# EAGLE design PowerDistribution (EAGLE 6.5.0)
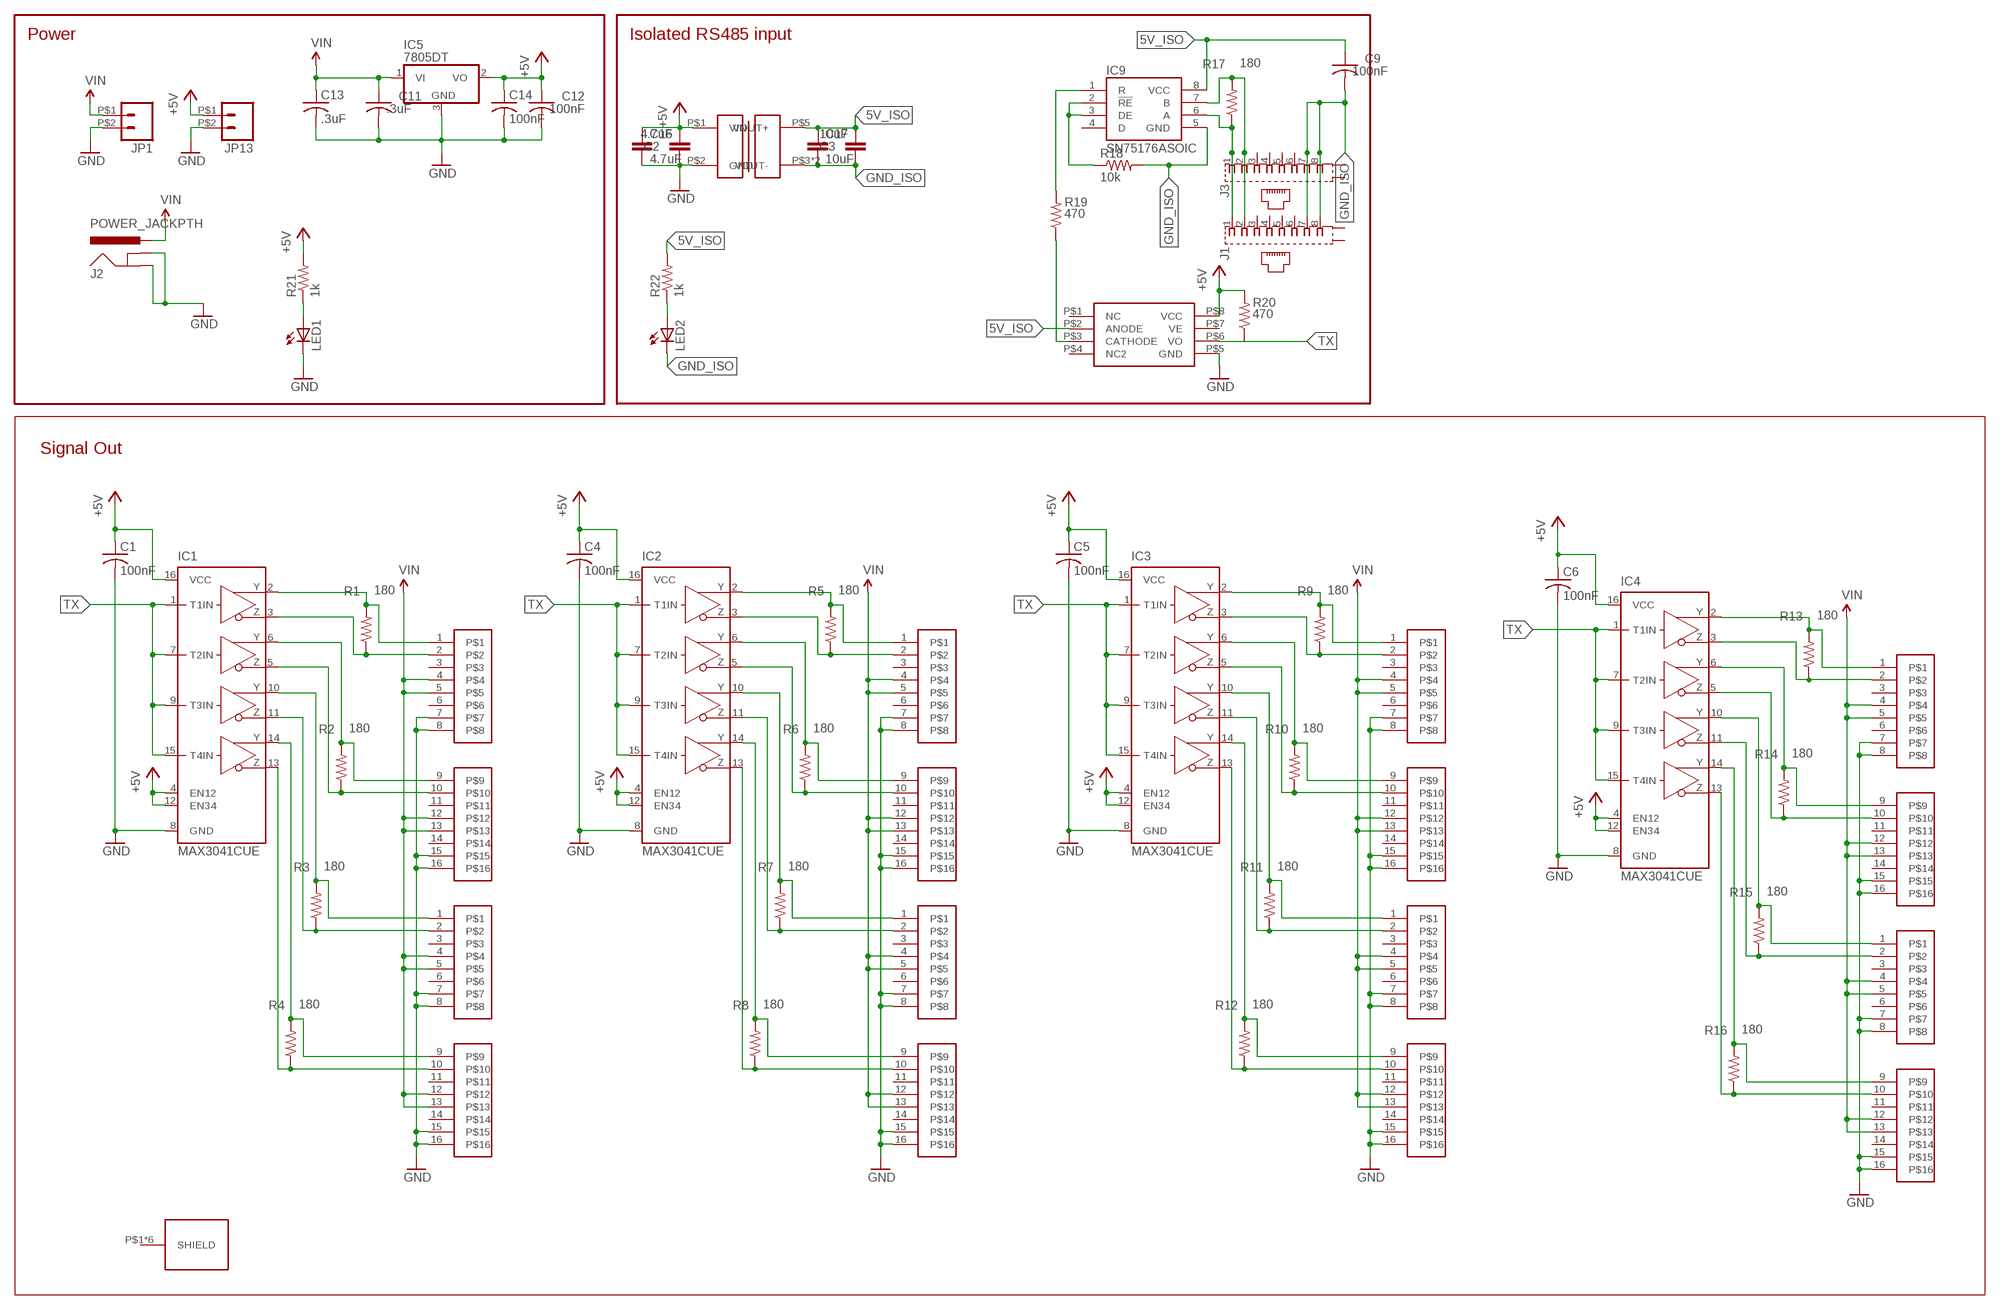
[diagram p0: schematic, sheet 1]

## Parts
C1  100nF  C-USC0603  [C0603]
C2  4.7uF  CAP0805  [0805]
C3  10uF  CAP0805  [0805]
C4  100nF  C-USC0603  [C0603]
C5  100nF  C-USC0603  [C0603]
C6  100nF  C-USC0603  [C0603]
C9  100nF  C-USC0603  [C0603]
C11  .3uF  C-USC0603K  [C0603K]
C12  100nF  C-USC0603K  [C0603K]
C13  .3uF  C-USC0603K  [C0603K]
C14  100nF  C-USC0603K  [C0603K]
C16  4.7uF  CAP1210  [1210]
C17  10uF  CAP1210  [1210]
IC1  MAX3041CUE  [TSSOP16]
IC2  MAX3041CUE  [TSSOP16]
IC3  MAX3041CUE  [TSSOP16]
IC4  MAX3041CUE  [TSSOP16]
IC5  7805DT  [TO252]
IC9  SN75176ASOIC  [SO08]
J1  555153-1  [555153-1]
J2  POWER_JACKPTH  [POWER_JACK_PTH]
J3  555153-1  [555153-1]
JP1  M026.35MM  [SCREWTERMINAL-6.35MM-2]
JP13  M026.35MM  [SCREWTERMINAL-6.35MM-2]
LED1  LED5MM  [LED5MM]
LED2  LED5MM  [LED5MM]
R1  180  R-US_R0603  [R0603]
R2  180  R-US_R0603  [R0603]
R3  180  R-US_R0603  [R0603]
R4  180  R-US_R0603  [R0603]
R5  180  R-US_R0603  [R0603]
R6  180  R-US_R0603  [R0603]
R7  180  R-US_R0603  [R0603]
R8  180  R-US_R0603  [R0603]
R9  180  R-US_R0603  [R0603]
R10  180  R-US_R0603  [R0603]
R11  180  R-US_R0603  [R0603]
R12  180  R-US_R0603  [R0603]
R13  180  R-US_R0603  [R0603]
R14  180  R-US_R0603  [R0603]
R15  180  R-US_R0603  [R0603]
R16  180  R-US_R0603  [R0603]
R17  180  R-US_R0603  [R0603]
R18  10k  R-US_R0603  [R0603]
R19  470  R-US_R0603  [R0603]
R20  470  R-US_R0603  [R0603]
R21  1k  R-US_R0603  [R0603]
R22  1k  R-US_R0603  [R0603]
U$1  RJ45_8X2_JACK  [RJ45_8X2_JACK]
U$2  RJ45_8X2_JACK  [RJ45_8X2_JACK]
U$3  6N137  [8_SOIC]
U$4  RJ45_8X2_BASE  [RJ45_8X2_BASE]
U$5  RJ45_8X2_JACK  [RJ45_8X2_JACK]
U$6  RJ45_8X2_JACK  [RJ45_8X2_JACK]
U$7  RJ45_8X2_JACK  [RJ45_8X2_JACK]
U$8  RJ45_8X2_JACK  [RJ45_8X2_JACK]
U$9  RJ45_8X2_JACK  [RJ45_8X2_JACK]
U$10  DC_DC_ISOLATED_0505  [IB_XLS-1W]
U$11  RJ45_8X2_JACK  [RJ45_8X2_JACK]

## Nets
5V_ISO: C3.2 C9.1 C17.1 IC9.8(VCC) R22.2 U$3.P$2(ANODE) U$10.P$5(VOUT+)
+5V: C1.1 C2.2 C4.1 C5.1 C6.1 C12.1 C14.1 C16.1 IC1.4(EN12) IC1.12(EN34) IC1.16(VCC) IC2.4(EN12) IC2.12(EN34) IC2.16(VCC) IC3.4(EN12) IC3.12(EN34) IC3.16(VCC) IC4.4(EN12) IC4.12(EN34) IC4.16(VCC) IC5.2(VO) JP13.P$1 R20.2 R21.2 U$3.P$8(VCC) U$10.P$1(VIN)
D9: IC9.2(!RE) IC9.3(DE) R18.1
GND [power]: C1.2 C2.1 C4.2 C5.2 C6.2 C11.2 C12.2 C13.2 C14.2 C16.2 IC1.8(GND) IC2.8(GND) IC3.8(GND) IC4.8(GND) IC5.3(GND) J2.GND J2.GNDBREAK JP1.P$2 JP13.P$2 LED1.K(C) U$1.7 U$1.8 U$1.15 U$1.16 U$2.7 U$2.8 U$2.15 U$2.16 U$3.P$5(GND) U$5.7 U$5.8 U$5.15 U$5.16 U$6.7 U$6.8 U$6.15 U$6.16 U$7.7 U$7.8 U$7.15 U$7.16 U$8.7 U$8.8 U$8.15 U$8.16 U$9.7 U$9.8 U$9.15 U$9.16 U$10.P$2(GND) U$11.7 U$11.8 U$11.15 U$11.16
GND_ISO: C3.1 C9.2 C17.2 IC9.5(GND) J1.7 J1.8 J3.7 J3.8 LED2.K(C) R18.2 U$10.P$3(VOUT-) U$10.P$4(VOUT-)
N$1: R19.1 U$3.P$3(CATHODE)
N$2: IC1.2(Y1) R1.2 U$5.1
N$3: IC9.1(R) R19.2
N$4: IC1.3(Z1) R1.1 U$5.2
N$5: IC1.13(Z4) R4.1 U$8.10
N$6: IC1.14(Y4) R4.2 U$8.9
N$7: IC1.11(Z3) R3.1 U$8.2
N$8: IC2.2(Y1) R5.2 U$1.1
N$9: IC1.10(Y3) R3.2 U$8.1
N$10: IC1.5(Z2) R2.1 U$5.10
N$11: IC1.6(Y2) R2.2 U$5.9
N$12: IC2.3(Z1) R5.1 U$1.2
N$13: IC2.13(Z4) R8.1 U$2.10
N$14: IC2.14(Y4) R8.2 U$2.9
N$15: IC2.11(Z3) R7.1 U$2.2
N$16: IC2.5(Z2) R6.1 U$1.10
N$17: IC2.6(Y2) R6.2 U$1.9
N$18: IC2.10(Y3) R7.2 U$2.1
N$19: IC3.2(Y1) R9.2 U$6.1
N$20: IC3.3(Z1) R9.1 U$6.2
N$21: IC3.13(Z4) R12.1 U$7.10
N$22: IC3.14(Y4) R12.2 U$7.9
N$23: IC3.11(Z3) R11.1 U$7.2
N$24: IC3.5(Z2) R10.1 U$6.10
N$25: IC3.6(Y2) R10.2 U$6.9
N$26: IC3.10(Y3) R11.2 U$7.1
N$27: IC4.2(Y1) R13.2 U$9.1
N$28: IC4.3(Z1) R13.1 U$9.2
N$29: IC4.13(Z4) R16.1 U$11.10
N$30: IC4.14(Y4) R16.2 U$11.9
N$31: IC4.11(Z3) R15.1 U$11.2
N$32: IC4.5(Z2) R14.1 U$9.10
N$33: IC4.6(Y2) R14.2 U$9.9
N$34: IC4.10(Y3) R15.2 U$11.1
N$35: J1.3
N$36: J1.4
N$37: J1.5
N$38: J1.6
N$39: LED1.A R21.1
N$40: LED2.A R22.1
RS485A9: IC9.6(A) J1.1 J3.1 R17.1
RS485B9: IC9.7(B) J1.2 J3.2 R17.2
TX: IC1.1(T1IN) IC1.7(T2IN) IC1.9(T3IN) IC1.15(T4IN) IC2.1(T1IN) IC2.7(T2IN) IC2.9(T3IN) IC2.15(T4IN) IC3.1(T1IN) IC3.7(T2IN) IC3.9(T3IN) IC3.15(T4IN) IC4.1(T1IN) IC4.7(T2IN) IC4.9(T3IN) IC4.15(T4IN) R20.1 U$3.P$6(VO)
VIN: C11.1 C13.1 IC5.1(VI) J2.PWR JP1.P$1 U$1.4 U$1.5 U$1.12 U$1.13 U$2.4 U$2.5 U$2.12 U$2.13 U$5.4 U$5.5 U$5.12 U$5.13 U$6.4 U$6.5 U$6.12 U$6.13 U$7.4 U$7.5 U$7.12 U$7.13 U$8.4 U$8.5 U$8.12 U$8.13 U$9.4 U$9.5 U$9.12 U$9.13 U$11.4 U$11.5 U$11.12 U$11.13
Unconnected: IC9.4(D) J1.G1(S1) J1.G2(S2) J3.3 J3.4 J3.5 J3.6 J3.G1(S1) J3.G2(S2) U$1.3 U$1.6 U$1.11 U$1.14 U$2.3 U$2.6 U$2.11 U$2.14 U$3.P$1(NC) U$3.P$4(NC2) U$3.P$7(VE) U$4.P$1(SHIELD) U$4.P$2(SHIELD) U$4.P$3(SHIELD) U$4.P$4(SHIELD) U$4.P$5(SHIELD) U$4.P$6(SHIELD) U$5.3 U$5.6 U$5.11 U$5.14 U$6.3 U$6.6 U$6.11 U$6.14 U$7.3 U$7.6 U$7.11 U$7.14 U$8.3 U$8.6 U$8.11 U$8.14 U$9.3 U$9.6 U$9.11 U$9.14 U$11.3 U$11.6 U$11.11 U$11.14

## Notes on the sheet
- Power | Isolated RS485 input
- Signal Out

## Library data of the parts
C1 C4-C6 C9 C11-C14 = adafruit:C-US: CAPACITOR, American symbol
C2 C3 C16 C17 = SparkFun:CAP: Capacitor Standard 0603 ceramic capacitor, and 0.1" leaded capacitor.
IC1-IC4 = maxim:MAX30*: ±10kV ESD-Protected, Quad 5V RS-485/RS-422 Transmitters Source: www.maxim-ic.com .. MAX3040-MAX3045.pdf; MPN: MAX3041CUE+; OC_FARNELL: unknown; OC_NEWARK: 73K8525
IC5 = linear:78*: Positive VOLTAGE REGULATOR Source: http://cache.national.com/ds/LM/LM78L05.pdf http://www.fairchildsemi.com/ds/LM/LM7805.pdf
IC9 = reprap:SN75176A
J1 J3 = con-amp:555153-1: AMP connector
J2 = SparkFun:POWER_JACK: Power Jack This is the standard 5.5mm barrel jack for power. The PTH is the most common, proven, reliable, footprint. All others are experimental. The Slot footprint only works if the mill layer is transmitted to the PCB fab house so be warned. Spark Fun Electronics SKU : PRT-00119. Mating wall wart : TOL-00298 (and others)
JP1 JP13 = SparkFun:M02: Header 2 Standard 2-pin 0.1" header. Use with straight break away headers (SKU : PRT-00116), right angle break away headers (PRT-00553), swiss pins (PRT-00743), machine pins (PRT-00117), and female headers (PRT-00115). Molex polarized connector foot print use with SKU : PRT-08233 with associated crimp pins and housings.
LED1 LED2 = SparkFun:LED: LEDs Standard schematic elements and footprints for 5mm, 3mm, 1206, and 0603 sized LEDs. 5mm - Spark Fun Electronics SKU : COM-00529 (and others)
R1-R22 = adafruit:R-US_: RESISTOR, American symbol
U$1 U$2 U$5-U$9 U$11 = LEDscape:RJ45_8X2_JACK
U$3 = sonos_library:6N137
U$4 = LEDscape:RJ45_8X2_BASE
U$10 = blinkinlabs:DC_DC_ISOLATED_0505: Galvanicly isolated 5v:5v converter. Could be a

## Net classes
0 default: width 0.254 mm
1 power: width 0.406 mm

## Board
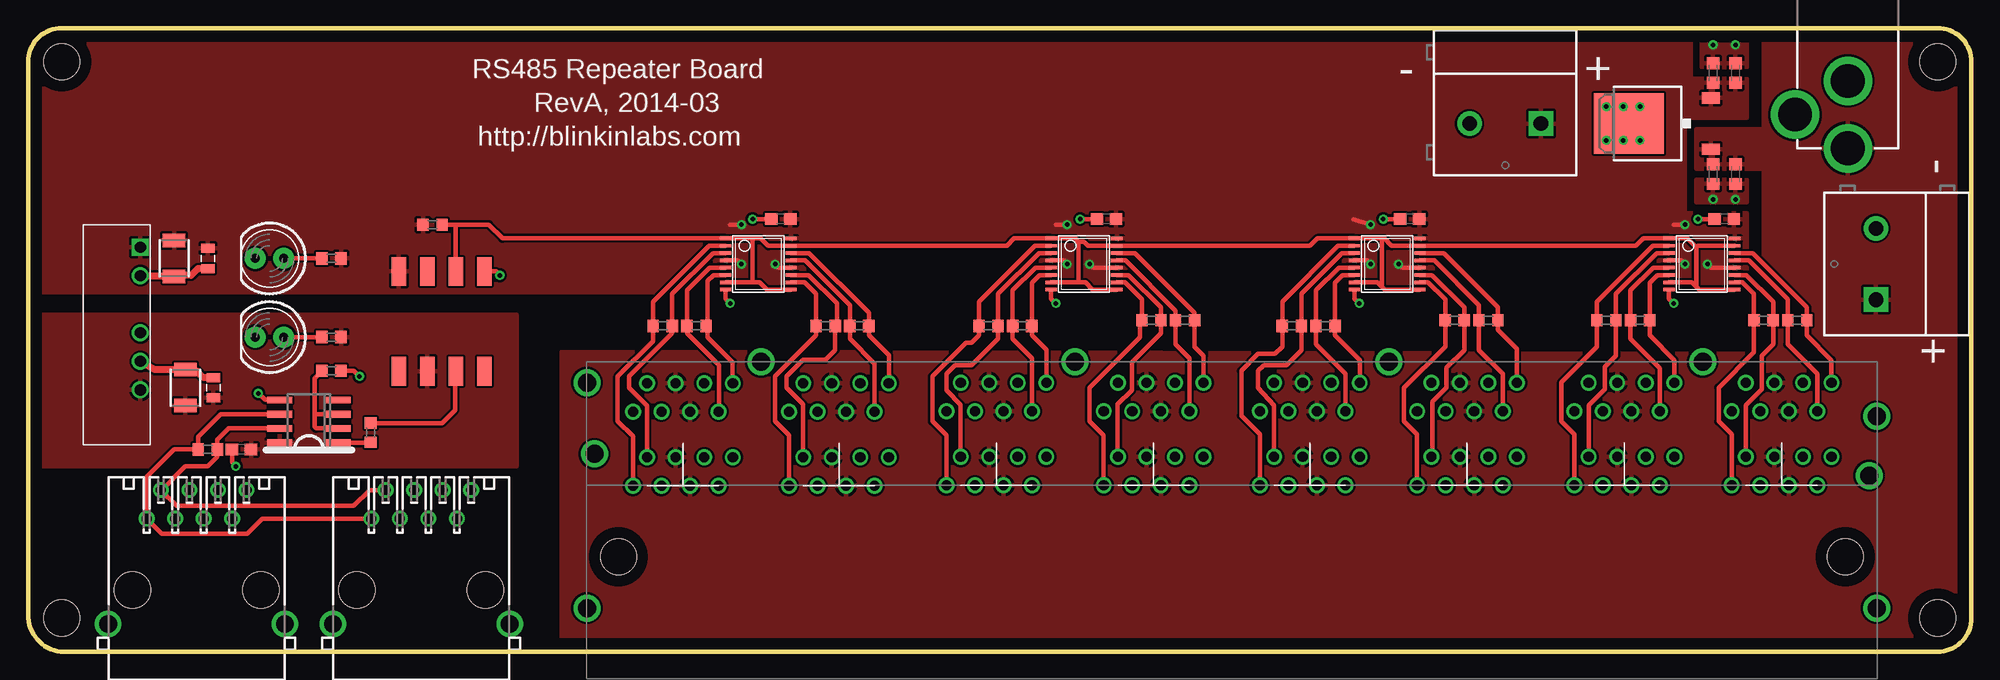
[diagram p1: board, top side]
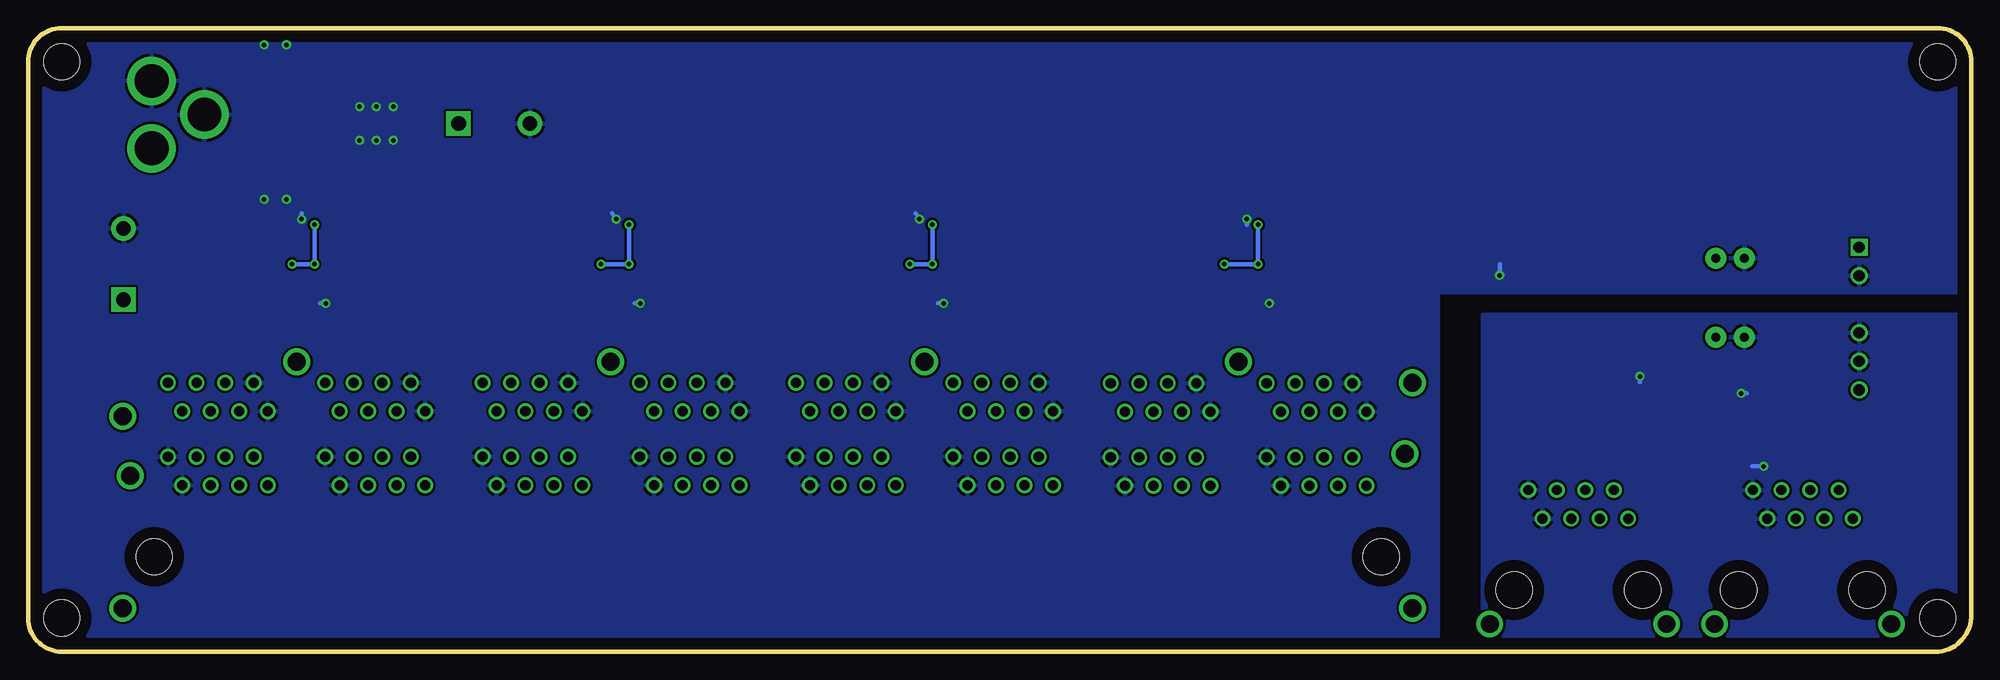
[diagram p2: board, bottom side, seen from below]

Size 173 x 55.51 mm. Coordinates in mm from the lower left corner, seen from the top.
Outline: 0,52.51 0,3.01 arc90 3.5,0.01 170,0.01 arc90 173,3.01 173,52.51 arc90 170,55.51 3,55.51 arc90 0,52.51
Copper layers (1*16): Top 0.035mm / dielectric 1.5mm / Bottom 0.035mm
Design rules "default *": minimum track width 10mil, minimum drill 0.3mm, track to track 8mil, track to pad 8mil, pad to pad 8mil, via to via 8mil, smd to smd 8mil, copper to edge 40mil, drill to drill 8mil, minimum pad ring 10mil, minimum via ring 8mil, stop-mask expansion 4mil, vias tented up to drill 0mil, thermal gap 10mil
Holes 3.2 mm at 3,52.51 3,3.01 170,3.01 170,52.51

### Footprints (pad centres in the part's own frame; a part is rotated, then mirrored left to right if it is on the bottom)
C0603 = smd 1.1 x 1: 1 -0.85,0; 2 0.85,0
0805 = smd 0.8 x 1.2: 1 -0.9,0; 2 0.9,0
C0603K = smd 1.05 x 1.08: 1 -0.875,0; 2 0.875,0
1210 = smd 1.2 x 2: 1 -1.6,0; 2 1.6,0
TSSOP16 = smd 0.305 x 0.991: 1 -2.275,-2.918; 2 -1.625,-2.918; 3 -0.975,-2.918; 4 -0.325,-2.918; 5 0.325,-2.918; 6 0.975,-2.918; 7 1.625,-2.918; 8 2.275,-2.918; 9 2.275,2.918; 10 1.625,2.918; 11 0.975,2.918; 12 0.325,2.918; 13 -0.325,2.918; 14 -0.975,2.918; 15 -1.625,2.918; 16 -2.275,2.918
TO252 = smd 1 x 1.6: 1 -2.28,-4.8; 2 2.28,-4.8 | smd 5.4 x 6.2: 3 0,2.5
SO08 = smd 0.6 x 2.2: 1 -1.905,-2.6; 2 -0.635,-2.6; 3 0.635,-2.6; 4 1.905,-2.6; 5 1.905,2.6; 6 0.635,2.6; 7 -0.635,2.6; 8 -1.905,2.6
555153-1 = drill 0.889: 1 -4.445,6.35; 2 -3.175,8.89; 3 -1.905,6.35; 4 -0.635,8.89; 5 0.635,6.35; 6 1.905,8.89; 7 3.175,6.35; 8 4.445,8.89 | drill 1.575 pad 2.184: G1 -7.874,-3.048; G2 7.874,-3.048 | hole 3.251: -5.715,0; 5.715,0
POWER_JACK_PTH = drill 2.997 pad 4.318: GND 0,7.7; GNDBREAK 4.7,10.7; PWR 0,13.7
SCREWTERMINAL-6.35MM-2 = drill 1.3 pad 2.184 square: P$1 -3.175,0 | drill 1.3 pad 2.184: P$2 3.175,0
LED5MM = drill 0.813 pad 1.88: A -1.27,0; K 1.27,0
R0603 = smd 1 x 1.1: 1 -0.85,0; 2 0.85,0
RJ45_8X2_JACK = drill 0.9: 1 -4.445,0; 2 -3.175,2.54; 3 -1.905,0; 4 -0.635,2.54; 5 0.635,0; 6 1.905,2.54; 7 3.175,0; 8 4.445,2.54; 9 4.445,9.14; 10 3.175,6.6; 11 1.905,9.14; 12 0.635,6.6; 13 -0.635,9.14; 14 -1.905,6.6; 15 -3.175,9.14; 16 -4.445,6.6
8_SOIC = smd 1.27 x 2.54: P$1 0,-2.54; P$2 2.54,-2.54; P$3 5.08,-2.54; P$4 7.62,-2.54; P$5 7.62,6.35; P$6 5.08,6.35; P$7 2.54,6.35; P$8 0,6.35
RJ45_8X2_BASE = drill 1.6: P$1 -57.4,15.5; P$2 -56.73,9.15; P$3 -57.4,-4.57; P$4 57.4,12.5; P$5 56.73,7.22; P$6 57.4,-4.57; P$7 13.97,17.35; P$8 41.91,17.35; P$9 -41.91,17.35; P$10 -13.97,17.35 | hole 3.2: -54.61,0; 54.61,0
IB_XLS-1W = drill 1 square: P$1 0,0 | drill 1: P$2 2.54,0; P$3 7.62,0; P$4 10.16,0; P$5 12.7,0

### Placement (x,y rotation side)
C1  67,38.51 180 top
C2  16,35.01 90 top
C3  16.5,23.51 270 top
C4  96,38.51 180 top
C5  123,38.51 180 top
C6  151,38.51 180 top
C9  19,18.01 180 top
C11  150,42.51 270 top
C12  152,51.51 90 top
C13  152,42.51 270 top
C14  150,51.51 90 top
C16  13,35.01 270 top
C17  14,23.51 90 top
IC1  65,34.51 270 top
IC2  94,34.51 270 top
IC3  121,34.51 270 top
IC4  149,34.51 270 top
IC5  145,47.01 90 top
IC9  25,20.51 90 top
J1  15,5.51 0 top
J2  162,58.51 180 top
J3  35,5.51 0 top
JP1  164.5,34.51 90 top
JP13  131.5,47.01 180 top
LED1  21.5,35.01 180 top
LED2  21.5,28.01 180 top
R1  56.5,29.01 180 top
R2  59.5,29.01 0 top
R3  71,29.01 180 top
R4  74,29.01 0 top
R5  85.5,29.01 180 top
R6  88.5,29.01 0 top
R7  100,29.51 180 top
R8  103,29.51 0 top
R9  112.5,29.01 180 top
R10  115.5,29.01 0 top
R11  127,29.51 180 top
R12  130,29.51 0 top
R13  140.5,29.51 180 top
R14  143.5,29.51 0 top
R15  154.5,29.51 180 top
R16  157.5,29.51 0 top
R17  16,18.01 0 top
R18  27,25.01 0 top
R19  30.5,19.51 270 top
R20  36,38.01 180 top
R21  27,35.01 0 top
R22  27,28.01 0 top
U$1  86.2,14.81 0 top
U$2  100.2,14.81 0 top
U$3  33,27.51 0 top
U$4  107.16,8.46 0 top
U$5  58.29,14.77 0 top
U$6  114.1,14.81 0 top
U$7  128.1,14.81 0 top
U$8  72.18,14.77 0 top
U$9  142.1,14.81 0 top
U$10  10,36.01 270 top
U$11  156.1,14.81 0 top

### Tracks (layer width: path | path; a pad name or v marks a point on that pad's centre or on a via)
5V_ISO
  pour Top: 43.5,30.01 0,30.01 0,16.51 43.5,16.51
+5V  (via drill 0.4)
  Top 0.406: IC1.4 63.17,34.83 v63.5,34.51 | IC1.12 66.83,34.18 v66.5,34.51 | v63.5,38.01 62.5,38.01 | IC2.4 92.17,34.83 v92.5,34.51 | v92.5,38.01 91.5,38.01 | IC2.12 94.83,34.18 v94.5,34.51 | IC3.4 119.17,34.83 v119.5,34.51 | v119.5,38.01 118,38.51 | IC3.12 122.33,34.18 v122,34.51 | IC4.4 147.18,34.83 v147.5,34.51 | v147.5,38.01 146.5,38.01 | IC4.12 149.82,34.18 v149.5,34.51
  Bottom 0.406: v63.5,38.01 v63.5,34.51 v66.5,34.51 | v92.5,38.01 v92.5,34.51 v94.5,34.51 | v119.5,38.01 v119.5,34.51 v122,34.51 | v147.5,38.01 v147.5,34.51 v149.5,34.51
  pour Top: 0,32.01 149,32.01 153,31.51 153,39.01 147.5,39.01 147.5,47.51 153,47.51 153,51.01 148,51.01 148,55.51 0,55.51
D9
  Top 0.406: IC9.3 25.5,21.14 | 25.5,21.14 25.5,24.36 R18.1 | IC9.2 25.64,19.87 25.5,20.01 25.5,21.14
GND  (via drill 0.4)
  Top 0.406: IC3.8 118.08,31.43 v118.5,31.01 | C5.2 v120.65,38.51 | C4.2 v93.65,38.51 | IC2.8 91.08,31.43 v91.5,31.01 | IC1.8 62.08,31.43 v62.5,31.01 | C1.2 v64.5,38.51 | C6.2 v148.65,38.51 | IC4.8 146.08,31.43 v146.5,31.01 | U$3.P$5 41.65,33.86 v42,33.51 | v143.5,45.51 143.5,46.01 IC5.3
  Top 0.61: U$10.P$2 12.94,33.47 C16.2 13.1,33.51 14.5,33.51 15.1,34.11 C2.1
  Bottom 0.406: v118.5,31.01 119,31.01 | v120.65,38.51 121,39.01 | v93.65,38.51 94,39.01 | v91.5,31.01 92,31.01 | v64.5,38.51 64.5,38.01 | v148.65,38.51 148.65,39.01 | v146.5,31.01 147,31.01 | v42,33.51 42,34.51
  other vias: 152,54.01 150,54.01 150,40.26 152,40.26 140.5,48.51 143.5,48.51 140.5,45.51 142,48.51 142,45.51
  pour Bottom: 47.5,0.01 173,0.01 173,55.51 0,55.51 0,32.01 47.5,32.01
  pour Top: 148.5,42.01 153,42.01 153,40.01 148.5,40.01
  pour Top: 149,54.51 153,54.51 153,52.01 149,52.01
GND_ISO  (via drill 0.4)
  Top 0.406: C9.2 18.15,16.86 v18.5,16.51 | IC9.5 21.09,22.41 v20.5,23.01 | R18.2 29,25.01 v29.5,24.51
  Top 0.61: U$10.P$4 11.26,25.11 C17.2 14.1,25.01 15,25.01 15.6,24.41 C3.1
  Bottom 0.406: v18.5,16.51 19.5,16.51 | v20.5,23.01 20,23.01 | v29.5,24.51 29.5,24.01
  pour Bottom: 43.5,-1.49 0,0.01 0,30.01 43.5,30.01
N$1
  Top 0.406: R19.1 36.85,20.36 38,21.51 38,24.89 U$3.P$3
N$2
  Top 0.406: IC1.2 60.62,36.13 55.65,31.16 R1.2 55.65,27.66 52.5,24.51 52.5,20.51 53.84,19.16 U$5.1
N$3
  Top 0.406: IC9.1 29.95,18.6 R19.2
N$4
  Top 0.406: IC1.3 60.98,35.48 57.35,31.86 R1.1 57.35,28.36 53.5,24.51 53.5,23.51 55.12,21.89 U$5.2
N$5
  Top 0.406: U$8.10 75.36,25.65 73.15,27.86 R4.1 73.15,30.86 69.17,34.83 IC1.13
N$6
  Top 0.406: U$8.9 76.62,26.38 74.85,28.16 R4.2 74.85,30.16 69.53,35.48 IC1.14
N$7
  Top 0.254: U$8.2 | 72,29.16 R3.1
  Top 0.406: R3.1 71.85,26.86 71,26.01 69,26.01 67.5,24.51 67.5,23.51 69,22.01 U$8.2 | IC1.11 69.47,33.53 72,31.01 72,29.16
N$8
  Top 0.406: IC2.2 89.62,36.13 84.65,31.16 R5.2 84.65,28.16 84,27.51 83.5,27.51 80.5,24.51 80.5,20.51 81.75,19.25 U$1.1
N$9
  Top 0.406: U$8.1 67.73,19.27 66.5,20.51 66.5,24.51 70.15,28.16 R3.2 70.15,31.86 69.12,32.88 IC1.10
N$10
  Top 0.254: 61.5,21.4 U$5.10
  Top 0.406: 61.5,21.4 61.5,25.51 58.65,28.36 R2.1 58.65,32.16 60.67,34.18 IC1.5
N$11
  Top 0.254: 60.5,28.86 R2.2 60.5,29.01
  Top 0.406: U$5.9 62.73,25.77 60.5,28.01 60.5,28.86 | 60.5,29.01 60.5,33.01 61.02,33.53 IC1.6
N$12
  Top 0.406: IC2.3 89.97,35.48 86.35,31.86 R5.1 86.35,27.86 84,25.51 82.5,25.51 81.75,24.76 81.75,23.26 83.03,21.98 U$1.2
N$13
  Top 0.406: U$2.10 103.38,26.13 102.15,27.36 R8.1 102.15,30.36 97.67,34.83 IC2.13
N$14
  Top 0.406: U$2.9 104.64,26.36 103.85,27.16 R8.2 103.85,30.16 98.53,35.48 IC2.14
N$15
  Top 0.406: U$2.2 97,17.37 97,22.01 98.25,23.26 98.25,25.76 100.85,28.36 R7.1 100.85,30.66 97.97,33.53 IC2.11
N$16
  Top 0.406: IC2.5 89.67,34.18 87.65,32.16 R6.1 87.65,27.86 89.38,26.13 U$1.10
N$17
  Top 0.406: IC2.6 90.03,33.53 89.35,32.86 R6.2 89.35,28.16 90.64,26.86 U$1.9
N$18
  Top 0.406: U$2.1 95.75,19.25 94.5,20.51 94.5,23.51 99,28.01 99,29.36 R7.2 99.15,31.36 97.62,32.88 IC2.10
N$19
  Top 0.406: U$6.1 109.66,19.35 108,21.01 108,25.01 109.5,26.51 111,26.51 111.65,27.16 R9.2 111.65,31.16 116.62,36.13 IC3.2
N$20
  Top 0.406: U$6.2 110.92,21.94 109.5,23.51 109.5,25.01 110,25.51 112,25.51 113.35,26.86 R9.1 113.35,31.86 116.97,35.48 IC3.3
N$21
  Top 0.406: U$7.10 131.28,24.73 129.15,26.86 R12.1 129.15,30.86 125.17,34.83 IC3.13
N$22
  Top 0.406: U$7.9 132.54,26.96 130.85,28.66 R12.2 130.85,30.66 126.03,35.48 IC3.14
N$23
  Top 0.406: U$7.2 125,17.42 125,22.26 126.25,23.51 126.25,25.26 127.85,26.86 R11.1 127.85,30.66 124.97,33.53 IC3.11
N$24
  Top 0.406: U$6.10 117.28,24.73 114.65,27.36 R10.1 114.65,32.16 116.67,34.18 IC3.5
N$25
  Top 0.406: U$6.9 118.55,25.96 116.35,28.16 R10.2 116.35,32.86 117.03,33.53 IC3.6
N$26
  Top 0.406: U$7.1 123.66,19.35 122.5,20.51 122.5,23.51 126.15,27.16 R11.2 126.15,31.36 124.62,32.88 IC3.10
N$27
  Top 0.406: U$9.1 137.66,19.35 136.5,20.51 136.5,24.01 139.65,27.16 R13.2 139.65,31.16 144.62,36.13 IC4.2
N$28
  Top 0.406: U$9.2 138.93,21.93 140.35,23.36 140.35,25.36 141.35,26.36 R13.1 141.35,31.86 144.97,35.48 IC4.3
N$29
  Top 0.406: U$11.10 159.28,24.73 156.65,27.36 R16.1 156.65,31.36 153.18,34.83 IC4.13
N$30
  Top 0.406: U$11.9 160.54,25.96 158.35,28.16 R16.2 158.35,30.66 153.53,35.48 IC4.14
N$31
  Top 0.406: U$11.2 152.93,21.93 154.35,23.36 154.35,26.36 155.35,27.36 R15.1 155.35,31.16 152.97,33.53 IC4.11
N$32
  Top 0.406: U$9.10 145.28,25.23 142.65,27.86 R14.1 142.65,32.16 144.68,34.18 IC4.5
N$33
  Top 0.406: U$9.9 146.54,25.96 144.35,28.16 R14.2 144.35,32.86 145.03,33.53 IC4.6
N$34
  Top 0.406: U$11.1 151.66,19.35 150.5,20.51 150.5,23.51 153.65,26.66 R15.2 153.65,31.86 152.62,32.88 IC4.10
N$39
  Top 0.406: R21.1 LED1.A
N$40
  Top 0.406: R22.1 LED2.A
RS485A9
  Top 0.406: IC9.6 17.14,21.14 15.15,19.16 R17.1 13,18.01 10.55,15.56 J1.1 11.9,10.51 19.5,10.51 20.85,11.86 J3.1
RS485B9
  Top 0.406: IC9.7 17.86,19.87 16.85,18.86 R17.2 16.85,17.36 16,16.51 14,16.51 11.89,14.4 J1.2 13.21,13.01 29,13.01 30.39,14.4 J3.2
TX
  Top 0.406: IC1.7 64.5,32.88 | 64.5,32.88 65.12,32.88 65.78,32.23 IC1.9 | 64.5,36.78 65.22,36.78 65.88,36.13 IC1.15 87.12,36.13 87.78,36.78 IC2.1 93.22,36.78 93.5,36.51 | 64.5,36.78 IC1.1 42.23,36.78 41,38.01 38,38.01 | 64.5,36.78 64.5,32.88 | IC2.7 93.5,32.88 | 93.5,32.88 94.12,32.88 94.78,32.23 IC2.9 | 93.5,36.51 94,36.51 94.38,36.13 IC2.15 114.12,36.13 114.78,36.78 IC3.1 120.5,36.78 | 93.5,36.51 93.5,32.88 | 120.5,36.78 120.72,36.78 121.38,36.13 IC3.15 143.12,36.13 143.78,36.78 IC4.1 147.72,36.78 148.5,36.01 | IC3.7 120.12,32.88 120.5,32.51 | 120.5,32.51 120.5,36.78 | IC3.9 120.78,32.23 120.5,32.51 | IC4.7 148.12,32.88 148.5,32.51 | 148.5,32.51 148.5,36.01 | IC4.9 148.78,32.23 148.5,32.51 | IC4.15 148.62,36.13 148.5,36.01 | 37.08,37.78 R20.1 38,38.01 | U$3.P$6 38.08,37.82 arc45 38,38.01
VIN
  pour Top: 47.5,0.01 173,0.01 173,55.51 154.5,55.51 154.5,46.51 148.5,46.51 148.5,43.01 154.5,43.01 154.5,26.51 47.5,26.71

### Text on the board
tNames: RS485 Repeater Board | - | + | RevA, 2014-03 | http://blinkinlabs.com | - | +